# Altium project ultrasound_pcb.PrjPcb
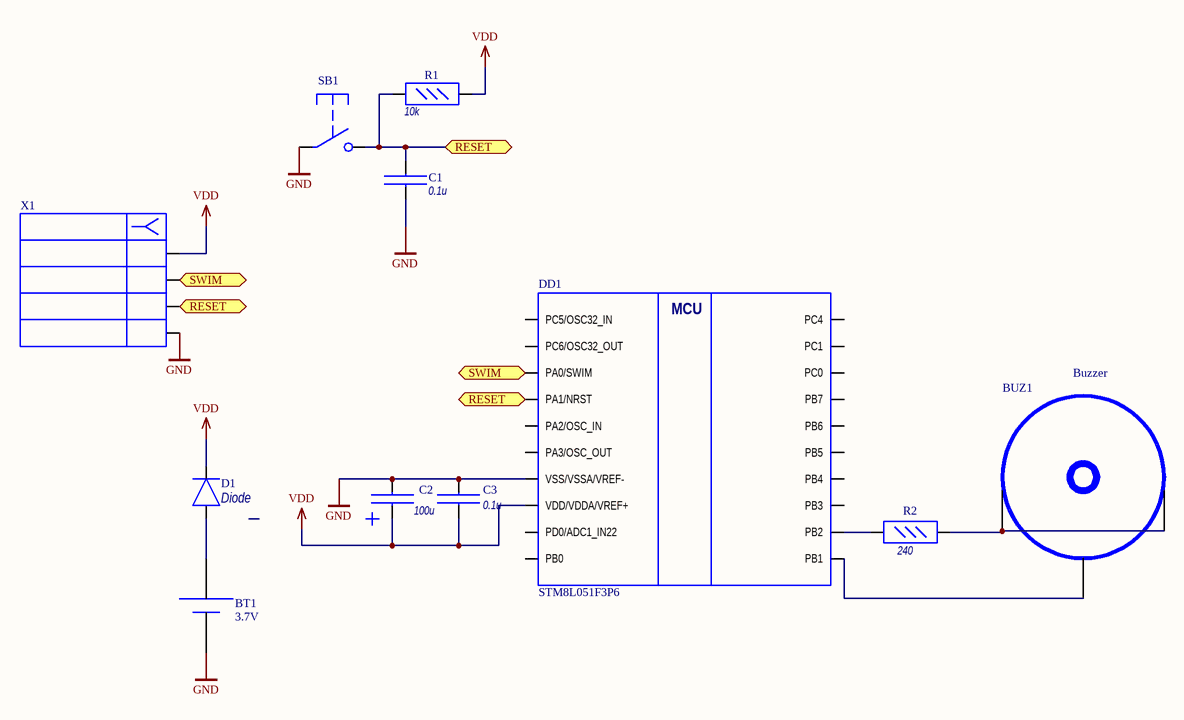
[diagram p0: Schema.SchDoc]
1 sheet, 11 parts. Net scope: flat (ports and power ports of the same name join across sheets).
Board file: PCB.PcbDoc

## Sheet Schema.SchDoc
size A4

### Parts
BT1  3.7V  [Battery]
BUZ1  Buzzer  [Buzzer]
C1  Cap: 0.1u  [CAPACITOR SMD 1206]  (hidden comment: Capacitor)
C2  Cap: 100u  [BigCapacitor]  (hidden comment: Capacitor (Polarized))
C3  Cap: 0.1u  [CAPACITOR SMD 1206]  (hidden comment: Capacitor)
D1  Diode  [SODFL250X110-2N]
DD1  STM8L051F3P6  [TSOP65P640X120-20N]
R1  R: 10k  [Resistor SMD 1206]  (hidden comment: Resistor (0.05W))
R2  R: 240  [Resistor SMD 1206]  (hidden comment: Resistor (0.05W))
SB1  Button  [BUTTON SMD]  (value not drawn)
X1  SWIM_Connector  [SWIM Connector]  (value not drawn)

### Ports
RESET, SWIM

### Nets
GND: BT1.2 C1.1 C2.2 C3.2 DD1.7(VSS/VSSA/VREF-) SB1.1 X1.4
VDD: C2.1 C3.1 D1.2 DD1.8(VDD/VDDA/VREF+) R1.1 X1.1
NetBT1_1: BT1.1 D1.1
NetBUZ1_1: BUZ1.1 BUZ1.2 R2.2
NetBUZ1_3: BUZ1.3 DD1.11(PB1)
NetC1_2: C1.2 DD1.4(PA1/NRST) R1.2 SB1.2 X1.3 ; port RESET
NetDD1_3: DD1.3(PA0/SWIM) X1.2 ; port SWIM
NetDD1_12: DD1.12(PB2) R2.1

Not connected (* = marked no-connect by the designer): DD1 1(PC5/OSC32_IN) 2(PC6/OSC32_OUT) 5(PA2/OSC_IN) 6(PA3/OSC_OUT) 9(PD0/ADC1_IN22) 10(PB0) 13(PB3) 14(PB4) 15(PB5) 16(PB6) 17(PB7) 18(PC0) 19(PC1) 20(PC4)

### Notes on the sheet
- (in symbol STM8L051F3P6 (TSSOP-20)) MCU

### Library data of the parts
BT1 = Battery
C2 = Capacitor (Polarized): pin to pad: 1>2 2>1
D1 = Diode: pin to pad: 1>2 2>1
DD1 = STM8L051F3P6 (TSSOP-20)